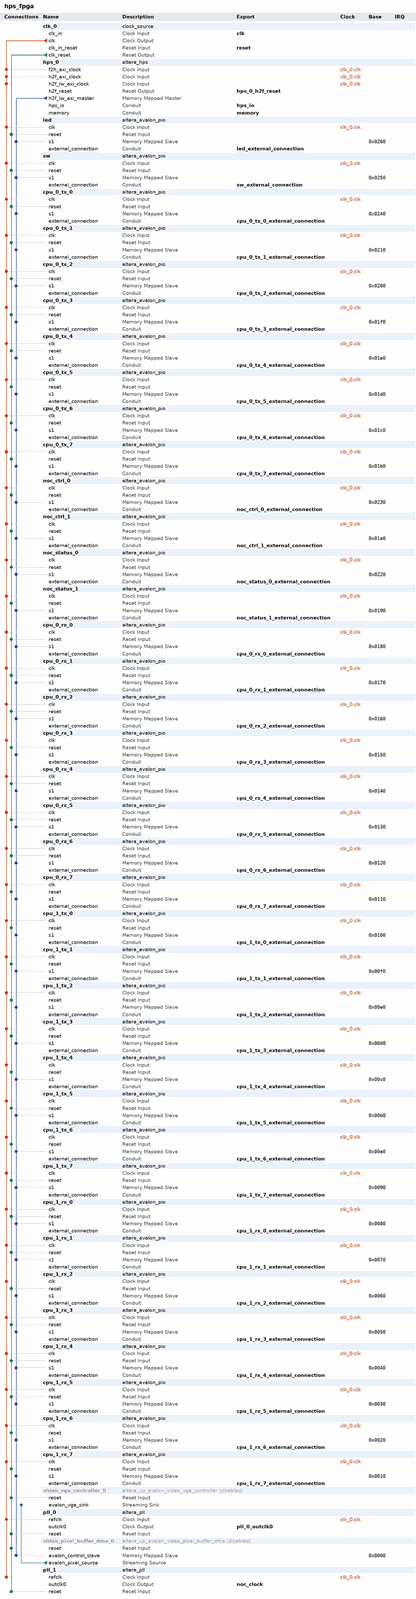
[diagram p0: system contents, whole]
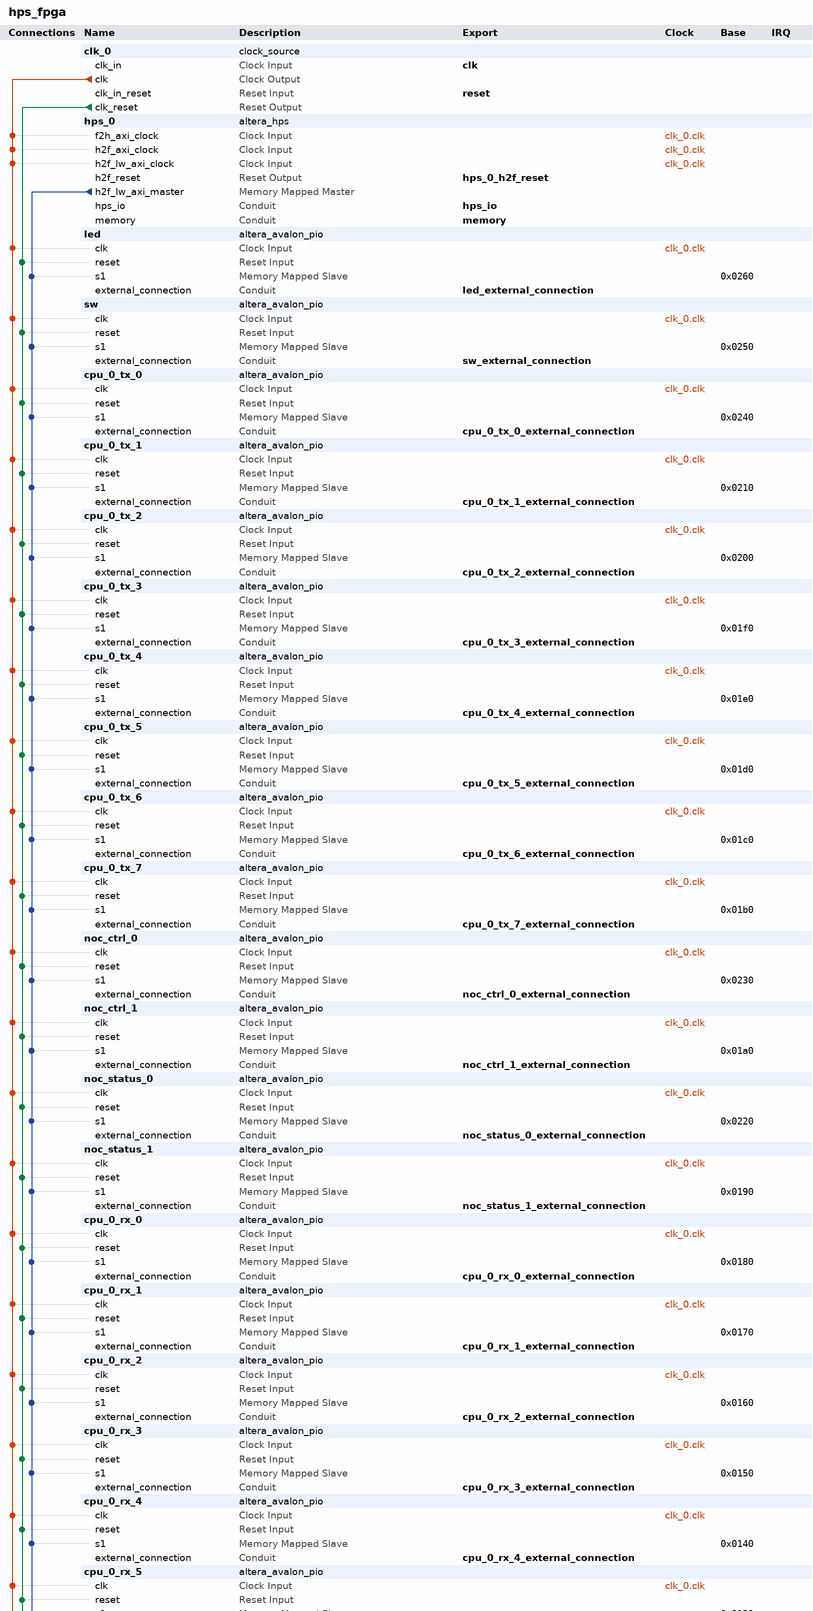
[diagram p1: system contents, upper part]
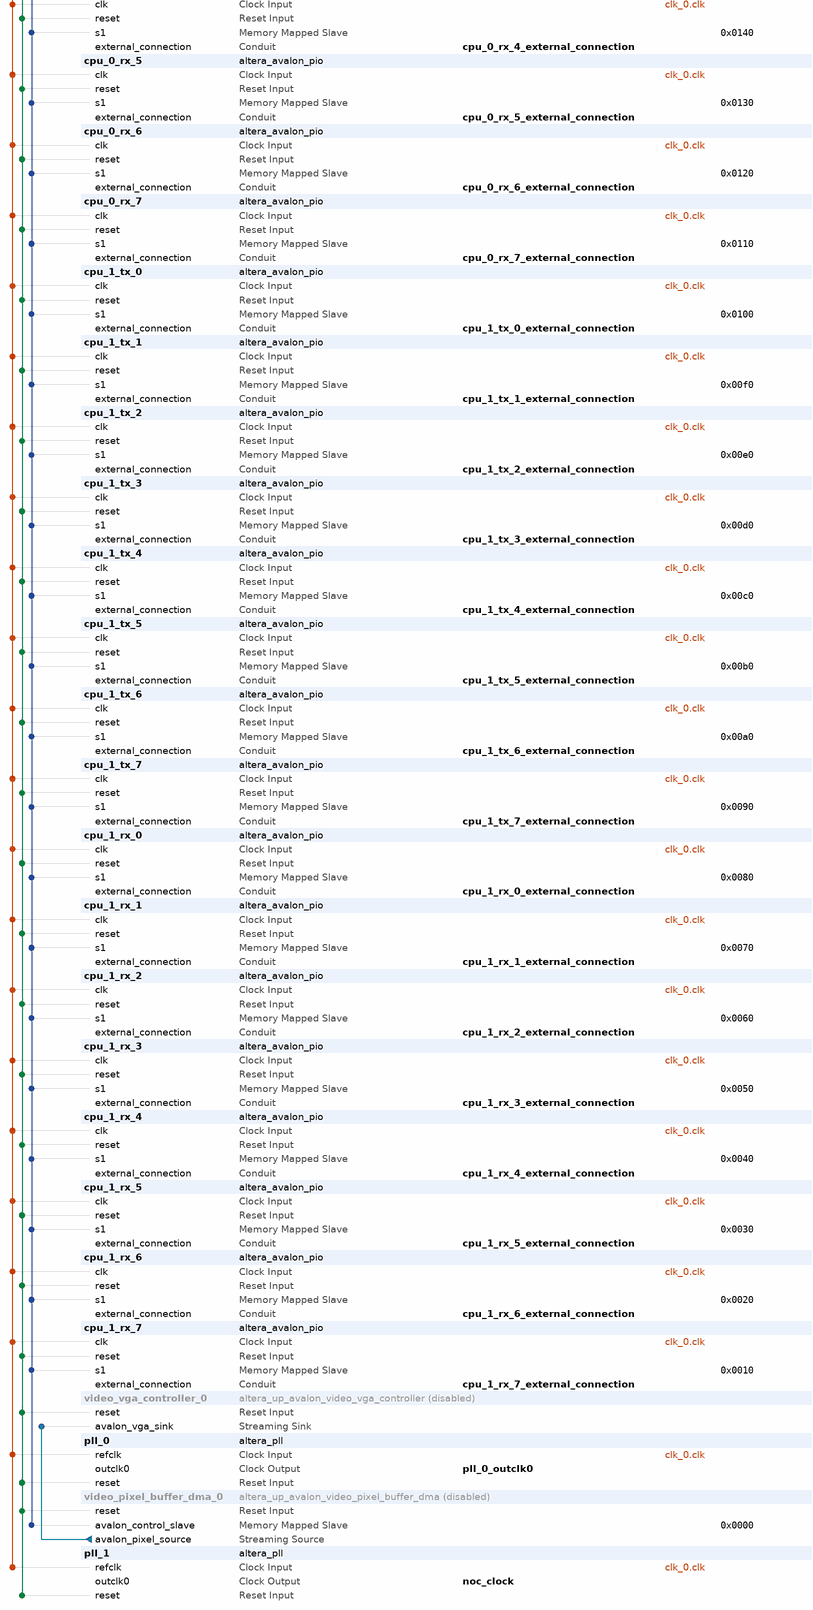
[diagram p2: system contents, lower part]
# Platform Designer (Qsys) system hps_fpga, Cyclone V 5CSEMA5F31C6
# Parameters at their usual value, and those the tool derives, are not listed.
package require -exact qsys 15.1
create_system hps_fpga
set_project_property DEVICE_FAMILY {Cyclone V}
set_project_property DEVICE 5CSEMA5F31C6

add_instance clk_0 clock_source 15.1
set_instance_parameter_value clk_0 clockFrequency 50000000

add_instance hps_0 altera_hps 15.1
set_instance_parameter_value hps_0 EMAC1_Mode RGMII
set_instance_parameter_value hps_0 EMAC1_PinMuxing {HPS I/O Set 0}
set_instance_parameter_value hps_0 F2SCLK_COLDRST_Enable false
set_instance_parameter_value hps_0 F2SCLK_DBGRST_Enable false
set_instance_parameter_value hps_0 F2SCLK_WARMRST_Enable false
set_instance_parameter_value hps_0 F2SINTERRUPT_Enable false
set_instance_parameter_value hps_0 F2S_Width 2
set_instance_parameter_value hps_0 FPGA_PERIPHERAL_OUTPUT_CLOCK_FREQ_EMAC0_GTX_CLK 100
set_instance_parameter_value hps_0 FPGA_PERIPHERAL_OUTPUT_CLOCK_FREQ_EMAC0_MD_CLK 100.0
set_instance_parameter_value hps_0 FPGA_PERIPHERAL_OUTPUT_CLOCK_FREQ_EMAC1_GTX_CLK 100
set_instance_parameter_value hps_0 FPGA_PERIPHERAL_OUTPUT_CLOCK_FREQ_EMAC1_MD_CLK 100.0
set_instance_parameter_value hps_0 HPS_PROTOCOL DDR3
set_instance_parameter_value hps_0 I2C0_Mode N/A
set_instance_parameter_value hps_0 I2C0_PinMuxing Unused
set_instance_parameter_value hps_0 I2C1_Mode N/A
set_instance_parameter_value hps_0 I2C1_PinMuxing Unused
set_instance_parameter_value hps_0 LWH2F_Enable true
set_instance_parameter_value hps_0 MEM_BANKADDR_WIDTH 3
set_instance_parameter_value hps_0 MEM_CLK_FREQ 400.0
set_instance_parameter_value hps_0 MEM_COL_ADDR_WIDTH 10
set_instance_parameter_value hps_0 MEM_DQ_WIDTH 32
set_instance_parameter_value hps_0 MEM_DRV_STR RZQ/7
set_instance_parameter_value hps_0 MEM_ROW_ADDR_WIDTH 15
set_instance_parameter_value hps_0 MEM_RTT_NOM RZQ/4
set_instance_parameter_value hps_0 MEM_RTT_WR {Dynamic ODT off}
set_instance_parameter_value hps_0 MEM_TCL 11
set_instance_parameter_value hps_0 MEM_TFAW_NS 30.0
set_instance_parameter_value hps_0 MEM_TRAS_NS 35.0
set_instance_parameter_value hps_0 MEM_TRCD_NS 13.75
set_instance_parameter_value hps_0 MEM_TRFC_NS 260.0
set_instance_parameter_value hps_0 MEM_TRP_NS 13.75
set_instance_parameter_value hps_0 MEM_VENDOR JEDEC
set_instance_parameter_value hps_0 MEM_WTCL 8
set_instance_parameter_value hps_0 QSPI_Mode N/A
set_instance_parameter_value hps_0 QSPI_PinMuxing Unused
set_instance_parameter_value hps_0 REF_CLK_FREQ 25.0
set_instance_parameter_value hps_0 S2FCLK_USER2CLK 1
set_instance_parameter_value hps_0 S2F_Width 2
set_instance_parameter_value hps_0 SDIO_Mode {4-bit Data}
set_instance_parameter_value hps_0 SDIO_PinMuxing {HPS I/O Set 0}
set_instance_parameter_value hps_0 SPIM1_Mode N/A
set_instance_parameter_value hps_0 SPIM1_PinMuxing Unused
set_instance_parameter_value hps_0 STM_Enable false
set_instance_parameter_value hps_0 TIMING_BOARD_AC_SKEW 0.03
set_instance_parameter_value hps_0 TIMING_BOARD_AC_TO_CK_SKEW 0.0
set_instance_parameter_value hps_0 TIMING_BOARD_DQ_TO_DQS_SKEW 0.0
set_instance_parameter_value hps_0 TIMING_BOARD_MAX_CK_DELAY 0.03
set_instance_parameter_value hps_0 TIMING_BOARD_MAX_DQS_DELAY 0.02
set_instance_parameter_value hps_0 TIMING_BOARD_SKEW_BETWEEN_DQS 0.08
set_instance_parameter_value hps_0 TIMING_BOARD_SKEW_CKDQS_DIMM_MAX 0.16
set_instance_parameter_value hps_0 TIMING_BOARD_SKEW_CKDQS_DIMM_MIN 0.09
set_instance_parameter_value hps_0 TIMING_BOARD_SKEW_WITHIN_DQS 0.01
set_instance_parameter_value hps_0 TIMING_TDH 65
set_instance_parameter_value hps_0 TIMING_TDQSCK 255
set_instance_parameter_value hps_0 TIMING_TDQSQ 125
set_instance_parameter_value hps_0 TIMING_TDS 30
set_instance_parameter_value hps_0 TIMING_TIH 140
set_instance_parameter_value hps_0 TIMING_TIS 180
set_instance_parameter_value hps_0 TIMING_TQSH 0.4
set_instance_parameter_value hps_0 UART0_Mode {No Flow Control}
set_instance_parameter_value hps_0 UART0_PinMuxing {HPS I/O Set 0}
set_instance_parameter_value hps_0 USB1_Mode SDR
set_instance_parameter_value hps_0 USB1_PinMuxing {HPS I/O Set 0}
set_instance_parameter_value hps_0 desired_cfg_clk_mhz 100.0
set_instance_parameter_value hps_0 desired_qspi_clk_mhz 400.0

add_instance led altera_avalon_pio 15.1
set_instance_parameter_value led direction Output
set_instance_parameter_value led resetValue 1023
set_instance_parameter_value led width 10

add_instance sw altera_avalon_pio 15.1
set_instance_parameter_value sw direction Input
set_instance_parameter_value sw width 10

add_instance cpu_0_tx_0 altera_avalon_pio 15.1
set_instance_parameter_value cpu_0_tx_0 direction Output
set_instance_parameter_value cpu_0_tx_0 width 32

add_instance cpu_0_tx_1 altera_avalon_pio 15.1
set_instance_parameter_value cpu_0_tx_1 direction Output
set_instance_parameter_value cpu_0_tx_1 width 32

add_instance cpu_0_tx_2 altera_avalon_pio 15.1
set_instance_parameter_value cpu_0_tx_2 direction Output
set_instance_parameter_value cpu_0_tx_2 width 32

add_instance cpu_0_tx_3 altera_avalon_pio 15.1
set_instance_parameter_value cpu_0_tx_3 direction Output
set_instance_parameter_value cpu_0_tx_3 width 32

add_instance cpu_0_tx_4 altera_avalon_pio 15.1
set_instance_parameter_value cpu_0_tx_4 direction Output
set_instance_parameter_value cpu_0_tx_4 width 32

add_instance cpu_0_tx_5 altera_avalon_pio 15.1
set_instance_parameter_value cpu_0_tx_5 direction Output
set_instance_parameter_value cpu_0_tx_5 width 32

add_instance cpu_0_tx_6 altera_avalon_pio 15.1
set_instance_parameter_value cpu_0_tx_6 direction Output
set_instance_parameter_value cpu_0_tx_6 width 32

add_instance cpu_0_tx_7 altera_avalon_pio 15.1
set_instance_parameter_value cpu_0_tx_7 direction Output
set_instance_parameter_value cpu_0_tx_7 width 32

add_instance noc_ctrl_0 altera_avalon_pio 15.1
set_instance_parameter_value noc_ctrl_0 direction Output
set_instance_parameter_value noc_ctrl_0 width 32

add_instance noc_ctrl_1 altera_avalon_pio 15.1
set_instance_parameter_value noc_ctrl_1 direction Output
set_instance_parameter_value noc_ctrl_1 width 32

add_instance noc_status_0 altera_avalon_pio 15.1
set_instance_parameter_value noc_status_0 direction Input
set_instance_parameter_value noc_status_0 width 32

add_instance noc_status_1 altera_avalon_pio 15.1
set_instance_parameter_value noc_status_1 direction Input
set_instance_parameter_value noc_status_1 width 32

add_instance cpu_0_rx_0 altera_avalon_pio 15.1
set_instance_parameter_value cpu_0_rx_0 direction Input
set_instance_parameter_value cpu_0_rx_0 width 32

add_instance cpu_0_rx_1 altera_avalon_pio 15.1
set_instance_parameter_value cpu_0_rx_1 direction Input
set_instance_parameter_value cpu_0_rx_1 width 32

add_instance cpu_0_rx_2 altera_avalon_pio 15.1
set_instance_parameter_value cpu_0_rx_2 direction Input
set_instance_parameter_value cpu_0_rx_2 width 32

add_instance cpu_0_rx_3 altera_avalon_pio 15.1
set_instance_parameter_value cpu_0_rx_3 direction Input
set_instance_parameter_value cpu_0_rx_3 width 32

add_instance cpu_0_rx_4 altera_avalon_pio 15.1
set_instance_parameter_value cpu_0_rx_4 direction Input
set_instance_parameter_value cpu_0_rx_4 width 32

add_instance cpu_0_rx_5 altera_avalon_pio 15.1
set_instance_parameter_value cpu_0_rx_5 direction Input
set_instance_parameter_value cpu_0_rx_5 width 32

add_instance cpu_0_rx_6 altera_avalon_pio 15.1
set_instance_parameter_value cpu_0_rx_6 direction Input
set_instance_parameter_value cpu_0_rx_6 width 32

add_instance cpu_0_rx_7 altera_avalon_pio 15.1
set_instance_parameter_value cpu_0_rx_7 direction Input
set_instance_parameter_value cpu_0_rx_7 width 32

add_instance cpu_1_tx_0 altera_avalon_pio 15.1
set_instance_parameter_value cpu_1_tx_0 direction Output
set_instance_parameter_value cpu_1_tx_0 width 32

add_instance cpu_1_tx_1 altera_avalon_pio 15.1
set_instance_parameter_value cpu_1_tx_1 direction Output
set_instance_parameter_value cpu_1_tx_1 width 32

add_instance cpu_1_tx_2 altera_avalon_pio 15.1
set_instance_parameter_value cpu_1_tx_2 direction Output
set_instance_parameter_value cpu_1_tx_2 width 32

add_instance cpu_1_tx_3 altera_avalon_pio 15.1
set_instance_parameter_value cpu_1_tx_3 direction Output
set_instance_parameter_value cpu_1_tx_3 width 32

add_instance cpu_1_tx_4 altera_avalon_pio 15.1
set_instance_parameter_value cpu_1_tx_4 direction Output
set_instance_parameter_value cpu_1_tx_4 width 32

add_instance cpu_1_tx_5 altera_avalon_pio 15.1
set_instance_parameter_value cpu_1_tx_5 direction Output
set_instance_parameter_value cpu_1_tx_5 width 32

add_instance cpu_1_tx_6 altera_avalon_pio 15.1
set_instance_parameter_value cpu_1_tx_6 direction Output
set_instance_parameter_value cpu_1_tx_6 width 32

add_instance cpu_1_tx_7 altera_avalon_pio 15.1
set_instance_parameter_value cpu_1_tx_7 direction Output
set_instance_parameter_value cpu_1_tx_7 width 32

add_instance cpu_1_rx_0 altera_avalon_pio 15.1
set_instance_parameter_value cpu_1_rx_0 direction Input
set_instance_parameter_value cpu_1_rx_0 width 32

add_instance cpu_1_rx_1 altera_avalon_pio 15.1
set_instance_parameter_value cpu_1_rx_1 direction Input
set_instance_parameter_value cpu_1_rx_1 width 32

add_instance cpu_1_rx_2 altera_avalon_pio 15.1
set_instance_parameter_value cpu_1_rx_2 direction Input
set_instance_parameter_value cpu_1_rx_2 width 32

add_instance cpu_1_rx_3 altera_avalon_pio 15.1
set_instance_parameter_value cpu_1_rx_3 direction Input
set_instance_parameter_value cpu_1_rx_3 width 32

add_instance cpu_1_rx_4 altera_avalon_pio 15.1
set_instance_parameter_value cpu_1_rx_4 direction Input
set_instance_parameter_value cpu_1_rx_4 width 32

add_instance cpu_1_rx_5 altera_avalon_pio 15.1
set_instance_parameter_value cpu_1_rx_5 direction Input
set_instance_parameter_value cpu_1_rx_5 width 32

add_instance cpu_1_rx_6 altera_avalon_pio 15.1
set_instance_parameter_value cpu_1_rx_6 direction Input
set_instance_parameter_value cpu_1_rx_6 width 32

add_instance cpu_1_rx_7 altera_avalon_pio 15.1
set_instance_parameter_value cpu_1_rx_7 direction Input
set_instance_parameter_value cpu_1_rx_7 width 32

add_instance video_vga_controller_0 altera_up_avalon_video_vga_controller 15.1
set_instance_property video_vga_controller_0 ENABLED false
set_instance_parameter_value video_vga_controller_0 board DE1-SoC
set_instance_parameter_value video_vga_controller_0 resolution {VGA 640x480}

add_instance pll_0 altera_pll 15.1
set_instance_parameter_value pll_0 gui_device_speed_grade 1
set_instance_parameter_value pll_0 gui_number_of_clocks 1
set_instance_parameter_value pll_0 gui_operation_mode direct
set_instance_parameter_value pll_0 gui_output_clock_frequency0 25.0
set_instance_parameter_value pll_0 gui_pll_mode {Integer-N PLL}
set_instance_parameter_value pll_0 gui_reference_clock_frequency 50.0
set_instance_parameter_value pll_0 gui_use_locked false

add_instance video_pixel_buffer_dma_0 altera_up_avalon_video_pixel_buffer_dma 15.1
set_instance_property video_pixel_buffer_dma_0 ENABLED false
set_instance_parameter_value video_pixel_buffer_dma_0 addr_mode X-Y
set_instance_parameter_value video_pixel_buffer_dma_0 back_start_address 0
set_instance_parameter_value video_pixel_buffer_dma_0 color_space {30-bit RGB}
set_instance_parameter_value video_pixel_buffer_dma_0 image_height 480
set_instance_parameter_value video_pixel_buffer_dma_0 image_width 640
set_instance_parameter_value video_pixel_buffer_dma_0 start_address 0

add_instance pll_1 altera_pll 15.1
set_instance_parameter_value pll_1 gui_device_speed_grade 1
set_instance_parameter_value pll_1 gui_number_of_clocks 1
set_instance_parameter_value pll_1 gui_operation_mode direct
set_instance_parameter_value pll_1 gui_output_clock_frequency0 25.0
set_instance_parameter_value pll_1 gui_pll_mode {Integer-N PLL}
set_instance_parameter_value pll_1 gui_reference_clock_frequency 50.0
set_instance_parameter_value pll_1 gui_use_locked false

# connections
add_connection clk_0.clk cpu_0_rx_0.clk clock
add_connection clk_0.clk cpu_0_rx_1.clk clock
add_connection clk_0.clk cpu_0_rx_2.clk clock
add_connection clk_0.clk cpu_0_rx_3.clk clock
add_connection clk_0.clk cpu_0_rx_4.clk clock
add_connection clk_0.clk cpu_0_rx_5.clk clock
add_connection clk_0.clk cpu_0_rx_6.clk clock
add_connection clk_0.clk cpu_0_rx_7.clk clock
add_connection clk_0.clk cpu_0_tx_0.clk clock
add_connection clk_0.clk cpu_0_tx_1.clk clock
add_connection clk_0.clk cpu_0_tx_2.clk clock
add_connection clk_0.clk cpu_0_tx_3.clk clock
add_connection clk_0.clk cpu_0_tx_4.clk clock
add_connection clk_0.clk cpu_0_tx_5.clk clock
add_connection clk_0.clk cpu_0_tx_6.clk clock
add_connection clk_0.clk cpu_0_tx_7.clk clock
add_connection clk_0.clk cpu_1_rx_0.clk clock
add_connection clk_0.clk cpu_1_rx_1.clk clock
add_connection clk_0.clk cpu_1_rx_2.clk clock
add_connection clk_0.clk cpu_1_rx_3.clk clock
add_connection clk_0.clk cpu_1_rx_4.clk clock
add_connection clk_0.clk cpu_1_rx_5.clk clock
add_connection clk_0.clk cpu_1_rx_6.clk clock
add_connection clk_0.clk cpu_1_rx_7.clk clock
add_connection clk_0.clk cpu_1_tx_0.clk clock
add_connection clk_0.clk cpu_1_tx_1.clk clock
add_connection clk_0.clk cpu_1_tx_2.clk clock
add_connection clk_0.clk cpu_1_tx_3.clk clock
add_connection clk_0.clk cpu_1_tx_4.clk clock
add_connection clk_0.clk cpu_1_tx_5.clk clock
add_connection clk_0.clk cpu_1_tx_6.clk clock
add_connection clk_0.clk cpu_1_tx_7.clk clock
add_connection clk_0.clk hps_0.f2h_axi_clock clock
add_connection clk_0.clk hps_0.h2f_axi_clock clock
add_connection clk_0.clk hps_0.h2f_lw_axi_clock clock
add_connection clk_0.clk led.clk clock
add_connection clk_0.clk noc_ctrl_0.clk clock
add_connection clk_0.clk noc_ctrl_1.clk clock
add_connection clk_0.clk noc_status_0.clk clock
add_connection clk_0.clk noc_status_1.clk clock
add_connection clk_0.clk pll_0.refclk clock
add_connection clk_0.clk pll_1.refclk clock
add_connection clk_0.clk sw.clk clock
add_connection clk_0.clk_reset cpu_0_rx_0.reset reset
add_connection clk_0.clk_reset cpu_0_rx_1.reset reset
add_connection clk_0.clk_reset cpu_0_rx_2.reset reset
add_connection clk_0.clk_reset cpu_0_rx_3.reset reset
add_connection clk_0.clk_reset cpu_0_rx_4.reset reset
add_connection clk_0.clk_reset cpu_0_rx_5.reset reset
add_connection clk_0.clk_reset cpu_0_rx_6.reset reset
add_connection clk_0.clk_reset cpu_0_rx_7.reset reset
add_connection clk_0.clk_reset cpu_0_tx_0.reset reset
add_connection clk_0.clk_reset cpu_0_tx_1.reset reset
add_connection clk_0.clk_reset cpu_0_tx_2.reset reset
add_connection clk_0.clk_reset cpu_0_tx_3.reset reset
add_connection clk_0.clk_reset cpu_0_tx_4.reset reset
add_connection clk_0.clk_reset cpu_0_tx_5.reset reset
add_connection clk_0.clk_reset cpu_0_tx_6.reset reset
add_connection clk_0.clk_reset cpu_0_tx_7.reset reset
add_connection clk_0.clk_reset cpu_1_rx_0.reset reset
add_connection clk_0.clk_reset cpu_1_rx_1.reset reset
add_connection clk_0.clk_reset cpu_1_rx_2.reset reset
add_connection clk_0.clk_reset cpu_1_rx_3.reset reset
add_connection clk_0.clk_reset cpu_1_rx_4.reset reset
add_connection clk_0.clk_reset cpu_1_rx_5.reset reset
add_connection clk_0.clk_reset cpu_1_rx_6.reset reset
add_connection clk_0.clk_reset cpu_1_rx_7.reset reset
add_connection clk_0.clk_reset cpu_1_tx_0.reset reset
add_connection clk_0.clk_reset cpu_1_tx_1.reset reset
add_connection clk_0.clk_reset cpu_1_tx_2.reset reset
add_connection clk_0.clk_reset cpu_1_tx_3.reset reset
add_connection clk_0.clk_reset cpu_1_tx_4.reset reset
add_connection clk_0.clk_reset cpu_1_tx_5.reset reset
add_connection clk_0.clk_reset cpu_1_tx_6.reset reset
add_connection clk_0.clk_reset cpu_1_tx_7.reset reset
add_connection clk_0.clk_reset led.reset reset
add_connection clk_0.clk_reset noc_ctrl_0.reset reset
add_connection clk_0.clk_reset noc_ctrl_1.reset reset
add_connection clk_0.clk_reset noc_status_0.reset reset
add_connection clk_0.clk_reset noc_status_1.reset reset
add_connection clk_0.clk_reset pll_0.reset reset
add_connection clk_0.clk_reset pll_1.reset reset
add_connection clk_0.clk_reset sw.reset reset
add_connection clk_0.clk_reset video_pixel_buffer_dma_0.reset reset
add_connection clk_0.clk_reset video_vga_controller_0.reset reset
add_connection hps_0.h2f_lw_axi_master cpu_0_rx_0.s1 avalon
set_connection_parameter_value hps_0.h2f_lw_axi_master/cpu_0_rx_0.s1 baseAddress 0x0180
add_connection hps_0.h2f_lw_axi_master cpu_0_rx_1.s1 avalon
set_connection_parameter_value hps_0.h2f_lw_axi_master/cpu_0_rx_1.s1 baseAddress 0x0170
add_connection hps_0.h2f_lw_axi_master cpu_0_rx_2.s1 avalon
set_connection_parameter_value hps_0.h2f_lw_axi_master/cpu_0_rx_2.s1 baseAddress 0x0160
add_connection hps_0.h2f_lw_axi_master cpu_0_rx_3.s1 avalon
set_connection_parameter_value hps_0.h2f_lw_axi_master/cpu_0_rx_3.s1 baseAddress 0x0150
add_connection hps_0.h2f_lw_axi_master cpu_0_rx_4.s1 avalon
set_connection_parameter_value hps_0.h2f_lw_axi_master/cpu_0_rx_4.s1 baseAddress 0x0140
add_connection hps_0.h2f_lw_axi_master cpu_0_rx_5.s1 avalon
set_connection_parameter_value hps_0.h2f_lw_axi_master/cpu_0_rx_5.s1 baseAddress 0x0130
add_connection hps_0.h2f_lw_axi_master cpu_0_rx_6.s1 avalon
set_connection_parameter_value hps_0.h2f_lw_axi_master/cpu_0_rx_6.s1 baseAddress 0x0120
add_connection hps_0.h2f_lw_axi_master cpu_0_rx_7.s1 avalon
set_connection_parameter_value hps_0.h2f_lw_axi_master/cpu_0_rx_7.s1 baseAddress 0x0110
add_connection hps_0.h2f_lw_axi_master cpu_0_tx_0.s1 avalon
set_connection_parameter_value hps_0.h2f_lw_axi_master/cpu_0_tx_0.s1 baseAddress 0x0240
add_connection hps_0.h2f_lw_axi_master cpu_0_tx_1.s1 avalon
set_connection_parameter_value hps_0.h2f_lw_axi_master/cpu_0_tx_1.s1 baseAddress 0x0210
add_connection hps_0.h2f_lw_axi_master cpu_0_tx_2.s1 avalon
set_connection_parameter_value hps_0.h2f_lw_axi_master/cpu_0_tx_2.s1 baseAddress 0x0200
add_connection hps_0.h2f_lw_axi_master cpu_0_tx_3.s1 avalon
set_connection_parameter_value hps_0.h2f_lw_axi_master/cpu_0_tx_3.s1 baseAddress 0x01f0
add_connection hps_0.h2f_lw_axi_master cpu_0_tx_4.s1 avalon
set_connection_parameter_value hps_0.h2f_lw_axi_master/cpu_0_tx_4.s1 baseAddress 0x01e0
add_connection hps_0.h2f_lw_axi_master cpu_0_tx_5.s1 avalon
set_connection_parameter_value hps_0.h2f_lw_axi_master/cpu_0_tx_5.s1 baseAddress 0x01d0
add_connection hps_0.h2f_lw_axi_master cpu_0_tx_6.s1 avalon
set_connection_parameter_value hps_0.h2f_lw_axi_master/cpu_0_tx_6.s1 baseAddress 0x01c0
add_connection hps_0.h2f_lw_axi_master cpu_0_tx_7.s1 avalon
set_connection_parameter_value hps_0.h2f_lw_axi_master/cpu_0_tx_7.s1 baseAddress 0x01b0
add_connection hps_0.h2f_lw_axi_master cpu_1_rx_0.s1 avalon
set_connection_parameter_value hps_0.h2f_lw_axi_master/cpu_1_rx_0.s1 baseAddress 0x0080
add_connection hps_0.h2f_lw_axi_master cpu_1_rx_1.s1 avalon
set_connection_parameter_value hps_0.h2f_lw_axi_master/cpu_1_rx_1.s1 baseAddress 0x0070
add_connection hps_0.h2f_lw_axi_master cpu_1_rx_2.s1 avalon
set_connection_parameter_value hps_0.h2f_lw_axi_master/cpu_1_rx_2.s1 baseAddress 0x0060
add_connection hps_0.h2f_lw_axi_master cpu_1_rx_3.s1 avalon
set_connection_parameter_value hps_0.h2f_lw_axi_master/cpu_1_rx_3.s1 baseAddress 0x0050
add_connection hps_0.h2f_lw_axi_master cpu_1_rx_4.s1 avalon
set_connection_parameter_value hps_0.h2f_lw_axi_master/cpu_1_rx_4.s1 baseAddress 0x0040
add_connection hps_0.h2f_lw_axi_master cpu_1_rx_5.s1 avalon
set_connection_parameter_value hps_0.h2f_lw_axi_master/cpu_1_rx_5.s1 baseAddress 0x0030
add_connection hps_0.h2f_lw_axi_master cpu_1_rx_6.s1 avalon
set_connection_parameter_value hps_0.h2f_lw_axi_master/cpu_1_rx_6.s1 baseAddress 0x0020
add_connection hps_0.h2f_lw_axi_master cpu_1_rx_7.s1 avalon
set_connection_parameter_value hps_0.h2f_lw_axi_master/cpu_1_rx_7.s1 baseAddress 0x0010
add_connection hps_0.h2f_lw_axi_master cpu_1_tx_0.s1 avalon
set_connection_parameter_value hps_0.h2f_lw_axi_master/cpu_1_tx_0.s1 baseAddress 0x0100
add_connection hps_0.h2f_lw_axi_master cpu_1_tx_1.s1 avalon
set_connection_parameter_value hps_0.h2f_lw_axi_master/cpu_1_tx_1.s1 baseAddress 0x00f0
add_connection hps_0.h2f_lw_axi_master cpu_1_tx_2.s1 avalon
set_connection_parameter_value hps_0.h2f_lw_axi_master/cpu_1_tx_2.s1 baseAddress 0x00e0
add_connection hps_0.h2f_lw_axi_master cpu_1_tx_3.s1 avalon
set_connection_parameter_value hps_0.h2f_lw_axi_master/cpu_1_tx_3.s1 baseAddress 0x00d0
add_connection hps_0.h2f_lw_axi_master cpu_1_tx_4.s1 avalon
set_connection_parameter_value hps_0.h2f_lw_axi_master/cpu_1_tx_4.s1 baseAddress 0x00c0
add_connection hps_0.h2f_lw_axi_master cpu_1_tx_5.s1 avalon
set_connection_parameter_value hps_0.h2f_lw_axi_master/cpu_1_tx_5.s1 baseAddress 0x00b0
add_connection hps_0.h2f_lw_axi_master cpu_1_tx_6.s1 avalon
set_connection_parameter_value hps_0.h2f_lw_axi_master/cpu_1_tx_6.s1 baseAddress 0x00a0
add_connection hps_0.h2f_lw_axi_master cpu_1_tx_7.s1 avalon
set_connection_parameter_value hps_0.h2f_lw_axi_master/cpu_1_tx_7.s1 baseAddress 0x0090
add_connection hps_0.h2f_lw_axi_master led.s1 avalon
set_connection_parameter_value hps_0.h2f_lw_axi_master/led.s1 baseAddress 0x0260
add_connection hps_0.h2f_lw_axi_master noc_ctrl_0.s1 avalon
set_connection_parameter_value hps_0.h2f_lw_axi_master/noc_ctrl_0.s1 baseAddress 0x0230
add_connection hps_0.h2f_lw_axi_master noc_ctrl_1.s1 avalon
set_connection_parameter_value hps_0.h2f_lw_axi_master/noc_ctrl_1.s1 baseAddress 0x01a0
add_connection hps_0.h2f_lw_axi_master noc_status_0.s1 avalon
set_connection_parameter_value hps_0.h2f_lw_axi_master/noc_status_0.s1 baseAddress 0x0220
add_connection hps_0.h2f_lw_axi_master noc_status_1.s1 avalon
set_connection_parameter_value hps_0.h2f_lw_axi_master/noc_status_1.s1 baseAddress 0x0190
add_connection hps_0.h2f_lw_axi_master sw.s1 avalon
set_connection_parameter_value hps_0.h2f_lw_axi_master/sw.s1 baseAddress 0x0250
add_connection hps_0.h2f_lw_axi_master video_pixel_buffer_dma_0.avalon_control_slave avalon
set_connection_parameter_value hps_0.h2f_lw_axi_master/video_pixel_buffer_dma_0.avalon_control_slave baseAddress 0x0000
add_connection video_pixel_buffer_dma_0.avalon_pixel_source video_vga_controller_0.avalon_vga_sink avalon_streaming

# exported interfaces
add_interface clk clock sink
set_interface_property clk EXPORT_OF clk_0.clk_in
add_interface cpu_0_rx_0_external_connection conduit end
set_interface_property cpu_0_rx_0_external_connection EXPORT_OF cpu_0_rx_0.external_connection
add_interface cpu_0_rx_1_external_connection conduit end
set_interface_property cpu_0_rx_1_external_connection EXPORT_OF cpu_0_rx_1.external_connection
add_interface cpu_0_rx_2_external_connection conduit end
set_interface_property cpu_0_rx_2_external_connection EXPORT_OF cpu_0_rx_2.external_connection
add_interface cpu_0_rx_3_external_connection conduit end
set_interface_property cpu_0_rx_3_external_connection EXPORT_OF cpu_0_rx_3.external_connection
add_interface cpu_0_rx_4_external_connection conduit end
set_interface_property cpu_0_rx_4_external_connection EXPORT_OF cpu_0_rx_4.external_connection
add_interface cpu_0_rx_5_external_connection conduit end
set_interface_property cpu_0_rx_5_external_connection EXPORT_OF cpu_0_rx_5.external_connection
add_interface cpu_0_rx_6_external_connection conduit end
set_interface_property cpu_0_rx_6_external_connection EXPORT_OF cpu_0_rx_6.external_connection
add_interface cpu_0_rx_7_external_connection conduit end
set_interface_property cpu_0_rx_7_external_connection EXPORT_OF cpu_0_rx_7.external_connection
add_interface cpu_0_tx_0_external_connection conduit end
set_interface_property cpu_0_tx_0_external_connection EXPORT_OF cpu_0_tx_0.external_connection
add_interface cpu_0_tx_1_external_connection conduit end
set_interface_property cpu_0_tx_1_external_connection EXPORT_OF cpu_0_tx_1.external_connection
add_interface cpu_0_tx_2_external_connection conduit end
set_interface_property cpu_0_tx_2_external_connection EXPORT_OF cpu_0_tx_2.external_connection
add_interface cpu_0_tx_3_external_connection conduit end
set_interface_property cpu_0_tx_3_external_connection EXPORT_OF cpu_0_tx_3.external_connection
add_interface cpu_0_tx_4_external_connection conduit end
set_interface_property cpu_0_tx_4_external_connection EXPORT_OF cpu_0_tx_4.external_connection
add_interface cpu_0_tx_5_external_connection conduit end
set_interface_property cpu_0_tx_5_external_connection EXPORT_OF cpu_0_tx_5.external_connection
add_interface cpu_0_tx_6_external_connection conduit end
set_interface_property cpu_0_tx_6_external_connection EXPORT_OF cpu_0_tx_6.external_connection
add_interface cpu_0_tx_7_external_connection conduit end
set_interface_property cpu_0_tx_7_external_connection EXPORT_OF cpu_0_tx_7.external_connection
add_interface cpu_1_rx_0_external_connection conduit end
set_interface_property cpu_1_rx_0_external_connection EXPORT_OF cpu_1_rx_0.external_connection
add_interface cpu_1_rx_1_external_connection conduit end
set_interface_property cpu_1_rx_1_external_connection EXPORT_OF cpu_1_rx_1.external_connection
add_interface cpu_1_rx_2_external_connection conduit end
set_interface_property cpu_1_rx_2_external_connection EXPORT_OF cpu_1_rx_2.external_connection
add_interface cpu_1_rx_3_external_connection conduit end
set_interface_property cpu_1_rx_3_external_connection EXPORT_OF cpu_1_rx_3.external_connection
add_interface cpu_1_rx_4_external_connection conduit end
set_interface_property cpu_1_rx_4_external_connection EXPORT_OF cpu_1_rx_4.external_connection
add_interface cpu_1_rx_5_external_connection conduit end
set_interface_property cpu_1_rx_5_external_connection EXPORT_OF cpu_1_rx_5.external_connection
add_interface cpu_1_rx_6_external_connection conduit end
set_interface_property cpu_1_rx_6_external_connection EXPORT_OF cpu_1_rx_6.external_connection
add_interface cpu_1_rx_7_external_connection conduit end
set_interface_property cpu_1_rx_7_external_connection EXPORT_OF cpu_1_rx_7.external_connection
add_interface cpu_1_tx_0_external_connection conduit end
set_interface_property cpu_1_tx_0_external_connection EXPORT_OF cpu_1_tx_0.external_connection
add_interface cpu_1_tx_1_external_connection conduit end
set_interface_property cpu_1_tx_1_external_connection EXPORT_OF cpu_1_tx_1.external_connection
add_interface cpu_1_tx_2_external_connection conduit end
set_interface_property cpu_1_tx_2_external_connection EXPORT_OF cpu_1_tx_2.external_connection
add_interface cpu_1_tx_3_external_connection conduit end
set_interface_property cpu_1_tx_3_external_connection EXPORT_OF cpu_1_tx_3.external_connection
add_interface cpu_1_tx_4_external_connection conduit end
set_interface_property cpu_1_tx_4_external_connection EXPORT_OF cpu_1_tx_4.external_connection
add_interface cpu_1_tx_5_external_connection conduit end
set_interface_property cpu_1_tx_5_external_connection EXPORT_OF cpu_1_tx_5.external_connection
add_interface cpu_1_tx_6_external_connection conduit end
set_interface_property cpu_1_tx_6_external_connection EXPORT_OF cpu_1_tx_6.external_connection
add_interface cpu_1_tx_7_external_connection conduit end
set_interface_property cpu_1_tx_7_external_connection EXPORT_OF cpu_1_tx_7.external_connection
add_interface hps_0_h2f_reset reset source
set_interface_property hps_0_h2f_reset EXPORT_OF hps_0.h2f_reset
add_interface hps_io conduit end
set_interface_property hps_io EXPORT_OF hps_0.hps_io
add_interface led_external_connection conduit end
set_interface_property led_external_connection EXPORT_OF led.external_connection
add_interface memory conduit end
set_interface_property memory EXPORT_OF hps_0.memory
add_interface noc_clock clock source
set_interface_property noc_clock EXPORT_OF pll_1.outclk0
add_interface noc_ctrl_0_external_connection conduit end
set_interface_property noc_ctrl_0_external_connection EXPORT_OF noc_ctrl_0.external_connection
add_interface noc_ctrl_1_external_connection conduit end
set_interface_property noc_ctrl_1_external_connection EXPORT_OF noc_ctrl_1.external_connection
add_interface noc_status_0_external_connection conduit end
set_interface_property noc_status_0_external_connection EXPORT_OF noc_status_0.external_connection
add_interface noc_status_1_external_connection conduit end
set_interface_property noc_status_1_external_connection EXPORT_OF noc_status_1.external_connection
add_interface pll_0_outclk0 clock source
set_interface_property pll_0_outclk0 EXPORT_OF pll_0.outclk0
add_interface reset reset sink
set_interface_property reset EXPORT_OF clk_0.clk_in_reset
add_interface sw_external_connection conduit end
set_interface_property sw_external_connection EXPORT_OF sw.external_connection

set_interconnect_requirement {$system} qsys_mm.clockCrossingAdapter HANDSHAKE
set_interconnect_requirement {$system} qsys_mm.insertDefaultSlave FALSE
set_interconnect_requirement {$system} qsys_mm.maxAdditionalLatency 1

save_system hps_fpga.qsys
